# EAGLE design Dual Power Suppl Center T (EAGLE 9.6.2)
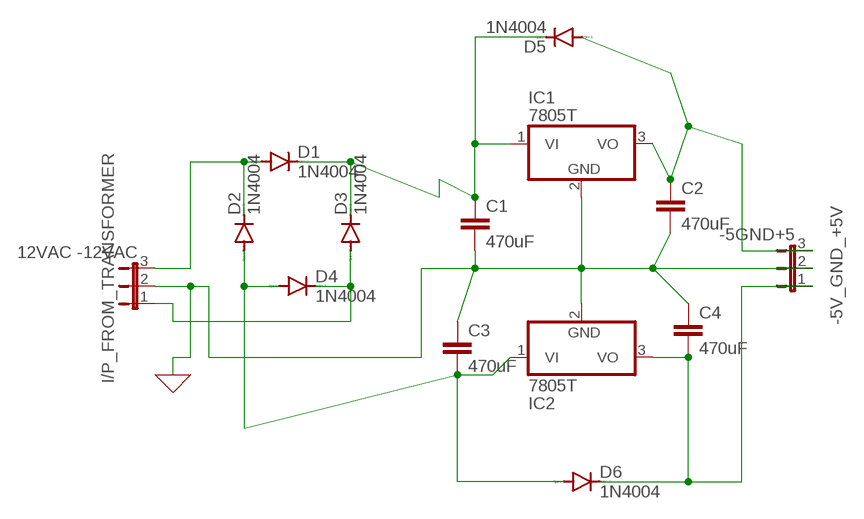
[diagram p0: schematic, sheet 1]

## Parts
-5V_GND_+5V  -5GND+5  JP2E  [JP2]
C1  470uF  C2,5-3  [C2.5-3]
C2  470uF  C2,5-3  [C2.5-3]
C3  470uF  C2,5-3  [C2.5-3]
C4  470uF  C2,5-3  [C2.5-3]
D1  1N4004  [DO41-10]
D2  1N4004  [DO41-10]
D3  1N4004  [DO41-10]
D4  1N4004  [DO41-10]
D5  1N4004  [DO41-10]
D6  1N4004  [DO41-10]
I/P_FROM_TRANSFORMER  12VAC -12VAC  JP2E  [JP2]
IC1  7805T  [TO220H]
IC2  7805T  [TO220H]

## Nets
0: -5V_GND_+5V.2 C1.2 C2.2 C3.1 C4.1 I/P_FROM_TRANSFORMER.2 IC1.2(GND) IC2.2(GND) ; supply symbol labelled GND
N$1: C3.2 D2.A D4.A D6.A IC2.1(VI)
N$2: D1.A D2.C I/P_FROM_TRANSFORMER.3
N$3: C1.1 D1.C D3.C D5.C IC1.1(VI)
N$4: D3.A D4.C I/P_FROM_TRANSFORMER.1
N$6: -5V_GND_+5V.3 C2.1 D5.A IC1.3(VO)
N$9: -5V_GND_+5V.1 C4.2 D6.C IC2.3(VO)

## Library data of the parts
-5V_GND_+5V I/P_FROM_TRANSFORMER = jumper:JP2E: JUMPER
C1-C4 = capacitor-wima:C: CAPACITOR naming: grid - package width
D1-D6 = diode:1N4004: DIODE general purpose rectifier, 1 A
IC1 IC2 = linear:78*: Positive VOLTAGE REGULATOR Source: http://cache.national.com/ds/LM/LM78L05.pdf http://www.fairchildsemi.com/ds/LM/LM7805.pdf

## Board
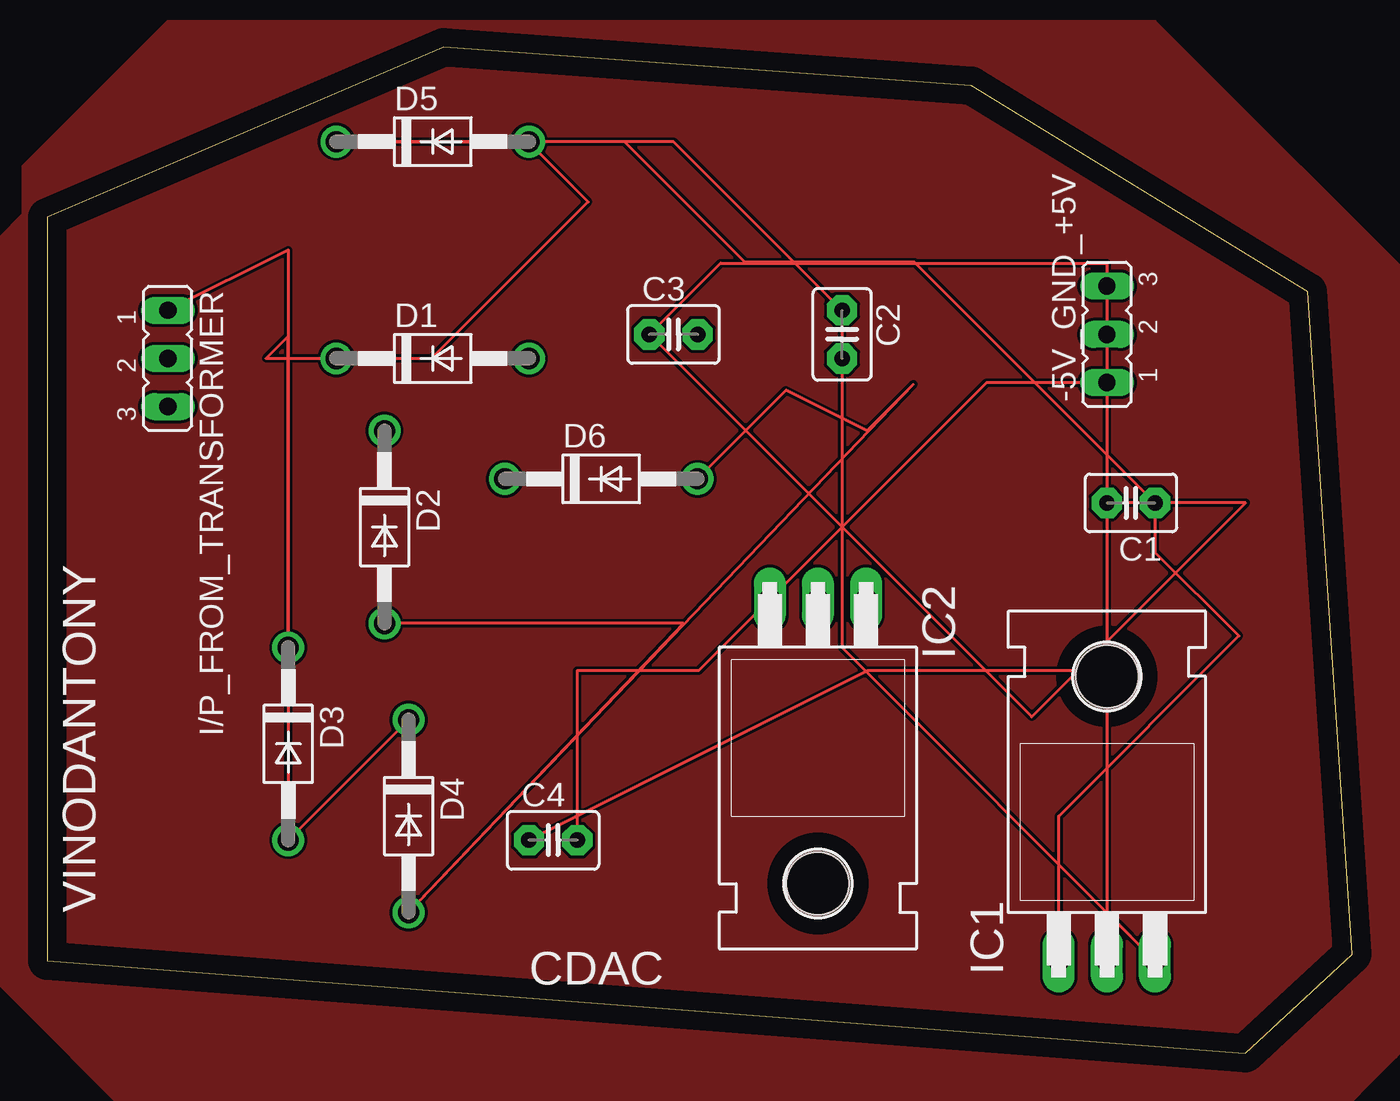
[diagram p1: board, top side]
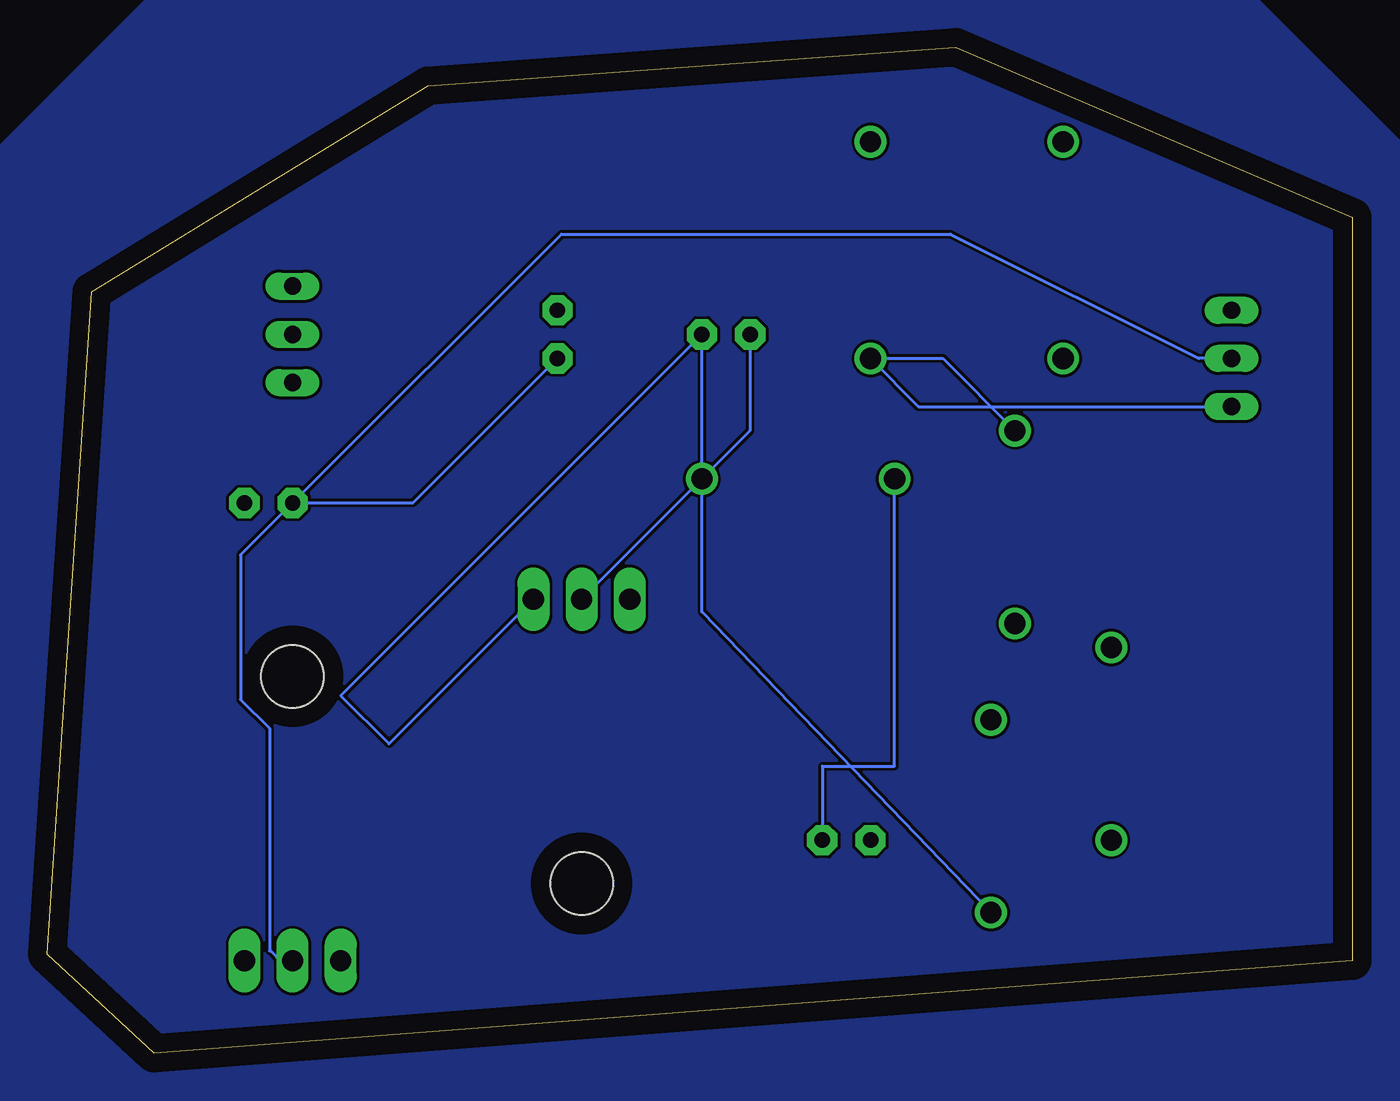
[diagram p2: board, bottom side, seen from below]

Size 68.81 x 53.03 mm. Coordinates in mm from the lower left corner, seen from the top.
Outline: 0,4.88 63.18,0 68.81,5.22 66.48,40.14 48.74,51.01 20.9,53.03 0,44.08 0,4.88
Copper layers (1*16): Top 0.035mm / dielectric 1.5mm / Bottom 0.035mm
Design rules "default": minimum track width 6mil, minimum drill 0.35mm, track to track 6mil, track to pad 6mil, pad to pad 6mil, via to via 6mil, smd to smd 6mil, copper to edge 40mil, drill to drill 6mil, minimum pad ring 10mil, minimum via ring 8mil, stop-mask expansion 4mil, vias tented up to drill 0mil, thermal gap 10mil

### Footprints (pad centres in the part's own frame; a part is rotated, then mirrored left to right if it is on the bottom)
JP2 = drill 0.914 long: 1 -2.54,0; 2 0,0; 3 2.54,0
C2.5-3 = drill 0.813 pad 1.6 octagon: 1 -1.27,0; 2 1.27,0
DO41-10 = drill 1.118: A 5.08,0; C -5.08,0
TO220H = drill 1.118 long: 1 -2.54,-10.16; 2 0,-10.16; 3 2.54,-10.16 | hole 3.302: 0,4.826

### Placement (x,y rotation side)
-5V_GND_+5V  55.88,37.9 90 top
C1  57.15,29.01 180 top
C2  41.91,37.9 270 top
C3  33.02,37.9 0 top
C4  26.67,11.23 0 top
D1  20.32,36.63 0 top
D2  17.78,27.74 270 top
D3  12.7,16.31 270 top
D4  19.05,12.5 270 top
D5  20.32,48.06 0 top
D6  29.21,30.28 0 top
I/P_FROM_TRANSFORMER  6.35,36.63 270 top
IC1  55.88,15.04 0 top
IC2  40.64,13.77 180 top

### Tracks (layer width: path | path; a pad name or v marks a point on that pad's centre or on a via)
0
  Top 0.152: -5V_GND_+5V.2 55.88,41.66 35.51,41.66 C3.1 51.92,17.74 54.36,20.18 | 54.36,20.18 43.28,20.18 C4.1 | 54.36,20.18 63.2,29.01 C1.2
  Bottom 0.152: C3.1 31.75,32.82 IC2.2 | I/P_FROM_TRANSFORMER.2 8.08,36.63 21.18,43.19 41.71,43.19 C1.2 | C1.2 49.53,29.01 C2.2 | IC1.2 56.54,4.88 57.05,5.39 57.1,5.39 57.1,17.13 58.62,18.65 58.62,26.27 C1.2
GND
  pour Top: -1.27,46.79 6.35,54.41 54.61,54.41 58.42,54.41 73.66,39.17 73.66,2.34 71.12,-0.2 67.31,-4.01 50.8,-4.01 5.08,-4.01 -2.54,3.61 -2.54,42.98 -1.27,44.25
  pour Bottom: -3.81,45.52 -3.81,46.79 6.35,56.95 62.23,56.95 63.5,55.68 77.47,41.71 77.47,37.9 77.47,-1.47 74.93,-4.01 69.85,-9.09 63.5,-9.09 1.27,-9.09 -3.81,-4.01
N$1
  Top 0.152: D6.A 38.96,34.96 43.23,32.82 45.67,35.26 D4.A 33.54,22.66 D2.A
  Bottom 0.152: IC2.1 50.8,16.31 53.34,18.85 C3.2 34.29,23.27 D4.A
N$2
  Bottom 0.152: I/P_FROM_TRANSFORMER.3 22.86,34.09 D1.A 21.59,36.63 D2.C
N$3
  Top 0.152: D3.C 12.7,37.8 11.53,36.63 D1.C 20.27,36.63 28.52,44.89 25.35,48.06 D5.C 30.43,48.06 36.78,41.71 45.72,41.71 C1.1 58.42,26.42 62.84,22 53.34,12.5 IC1.1
N$4
  Top 0.152: I/P_FROM_TRANSFORMER.1 12.7,42.35 D3.A D4.C
N$6
  Top 0.152: D5.A 33.02,48.06 C2.1 41.91,31.55 41.91,21.39 IC1.3 55.88,7.42 -5V_GND_+5V.3
N$9
  Top 0.152: -5V_GND_+5V.1 49.53,35.36 IC2.3 34.34,20.18 27.94,20.18 C4.2
  Bottom 0.152: D6.C 24.13,15.15 27.94,15.15 C4.2

### Text on the board
tPlace: VINODANTONY | CDAC